# EAGLE design Logging_board (EAGLE 8.4.1)
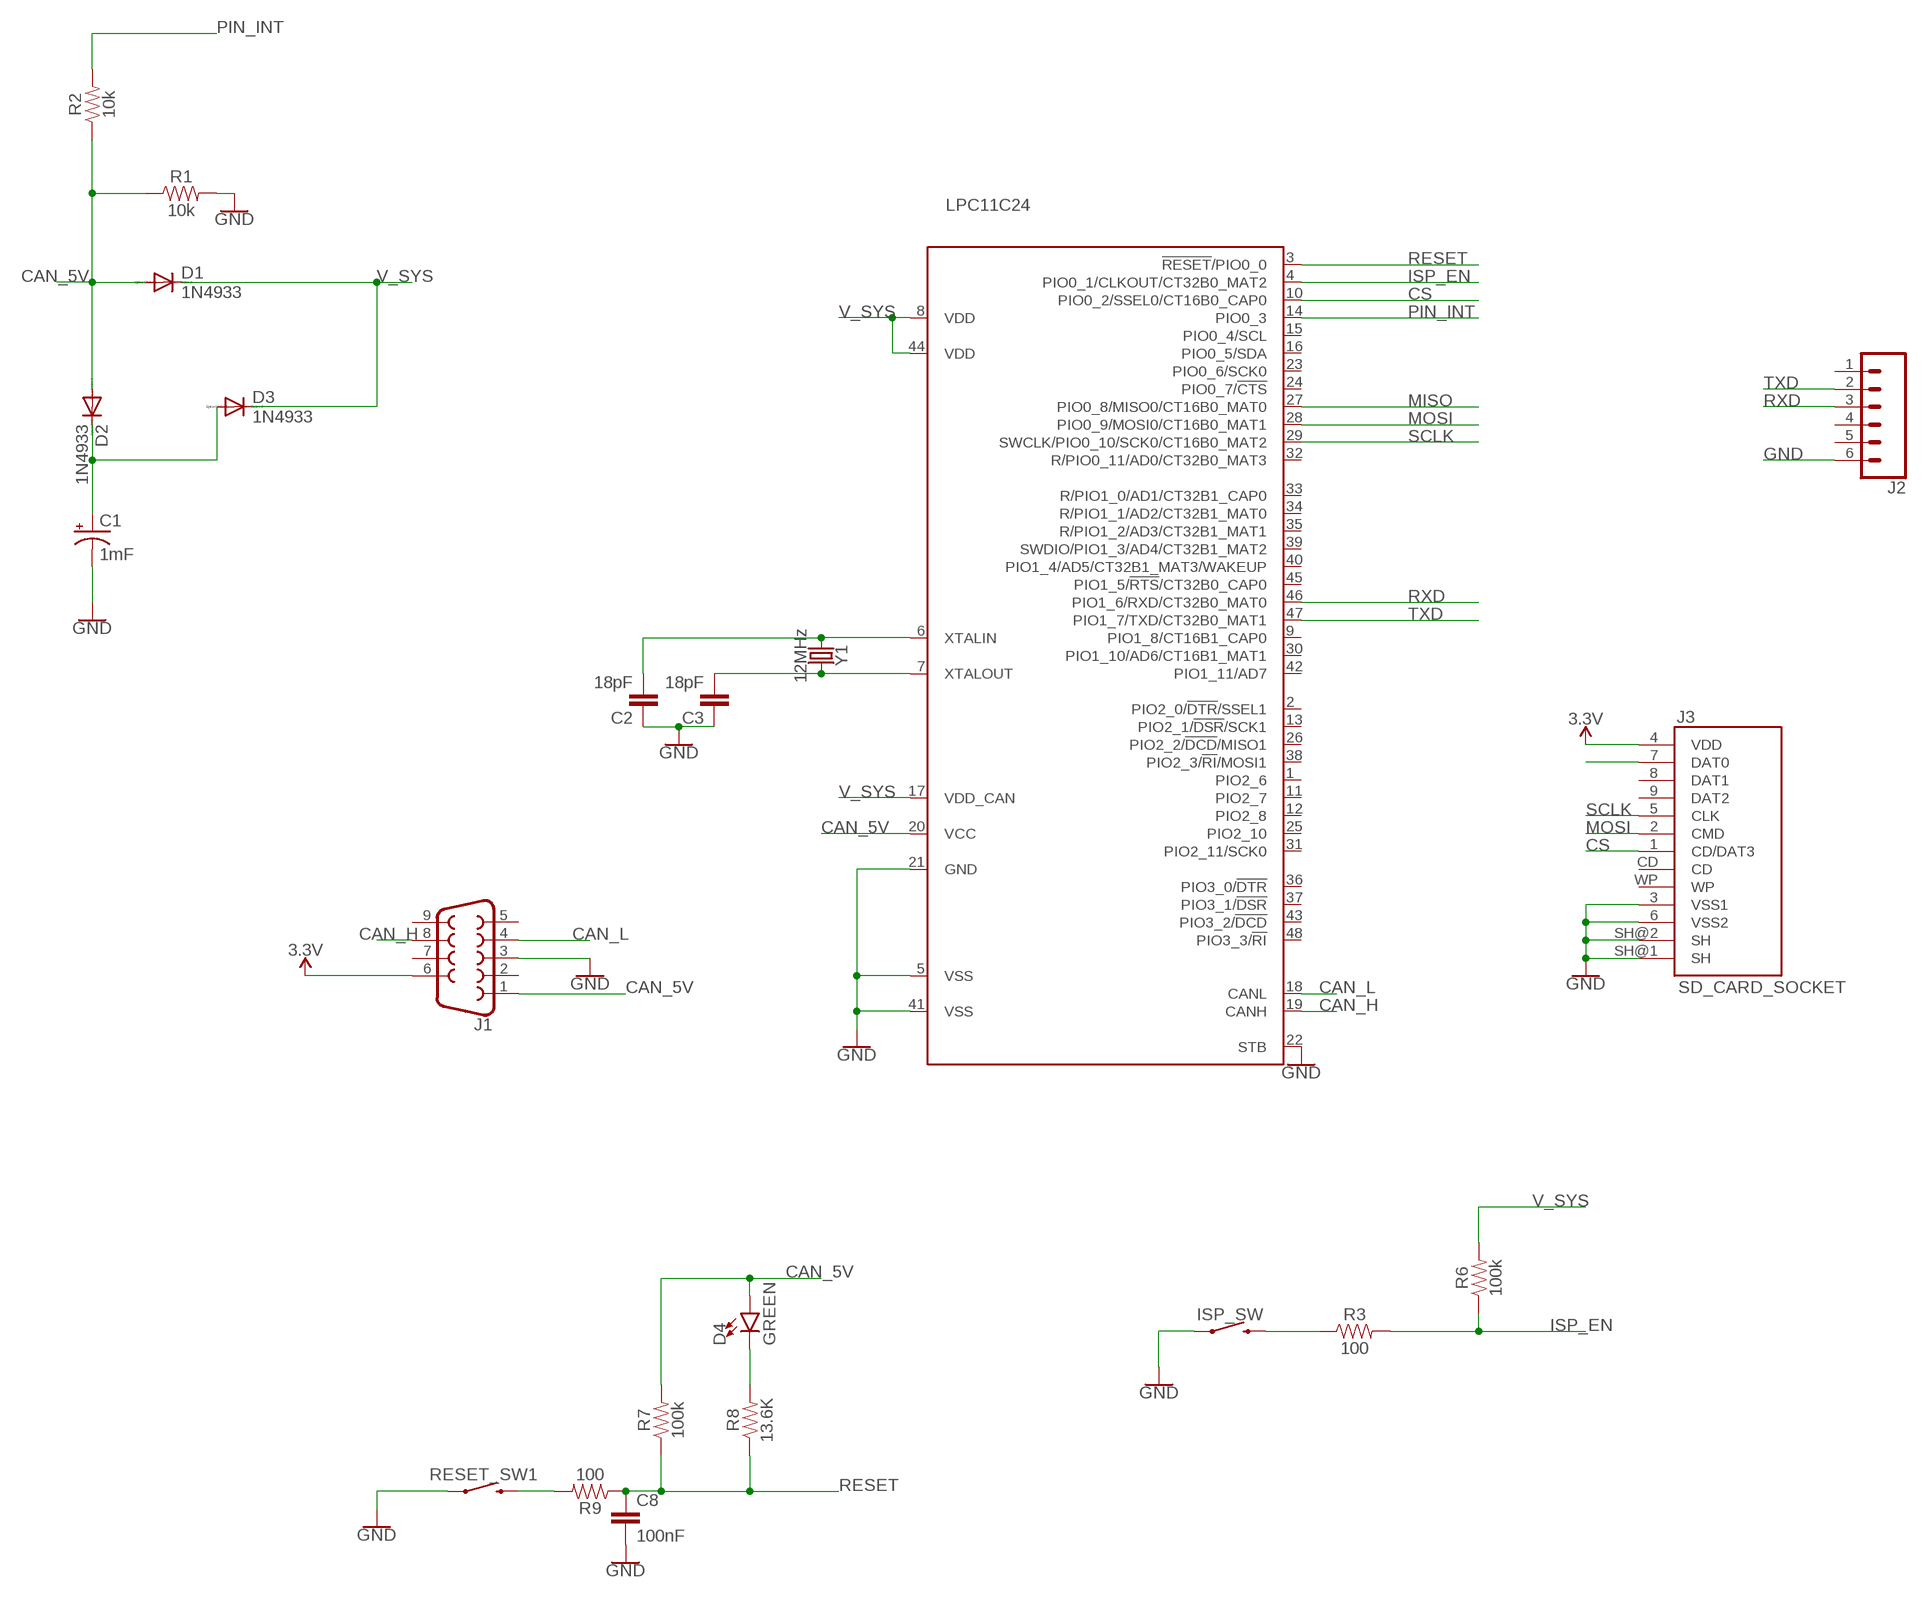
[diagram p0: schematic, sheet 1]

## Parts
C1  1mF  1000UF-RADIAL-5MM-25V-20%  [CPOL-RADIAL-5MM-10MM]
C2  18pF  22PF-PTH-2.54MM-200V-5%  [CAP-PTH-2.54]
C3  18pF  22PF-PTH-2.54MM-200V-5%  [CAP-PTH-2.54]
C8  100nF  22PF-PTH-2.54MM-200V-5%  [CAP-PTH-2.54]
D1  1N4933  [DO41-10]
D2  1N4933  [DO41-10]
D3  1N4933  [DO41-10]
D4  GREEN  LED-GREEN1206  [LED-1206]
ISP_SW  MOMENTARY-SWITCH-SPST-PTH-6.0MM  [TACTILE_SWITCH_PTH_6.0MM]
J1  DB9FEMALE  [DB9]
J2  CONN_06SILK_FEMALE_PTH  [1X06]
J3  SD_CARD_SOCKET  [SD]
LPC11C24  LPC11C22/24-LQFP48  [LQFP48]
R1  10k  10KOHM-HORIZ-1/4W-1%  [AXIAL-0.3]
R2  10k  10KOHM-HORIZ-1/4W-1%  [AXIAL-0.3]
R3  100  100OHM-HORIZ-1/4W-1%  [AXIAL-0.3]
R6  100k  100KOHM-HORIZ-1/4W-1%  [AXIAL-0.3]
R7  100k  100KOHM-HORIZ-1/4W-1%  [AXIAL-0.3]
R8  13.6K  100KOHM-HORIZ-1/4W-1%  [AXIAL-0.3]
R9  100  100KOHM-HORIZ-1/4W-1%  [AXIAL-0.3]
RESET_SW1  MOMENTARY-SWITCH-SPST-PTH-6.0MM  [TACTILE_SWITCH_PTH_6.0MM]
Y1  12MHz  CRYSTAL-16MHZPTH-HC49US  [HC49US]

## Nets
3.3V: J1.6 J3.4(VDD)
CAN_5V: D1.A D2.A D4.A J1.1 LPC11C24.20(VCC) R1.P$1 R2.P$1 R7.P$2
CAN_H: J1.8 LPC11C24.19(CANH)
CAN_L: J1.4 LPC11C24.18(CANL)
CS: J3.1(CD/DAT3) LPC11C24.10(PIO0_2/SSEL0/CT16B0_CAP0)
GND: C1.- C2.1 C3.1 C8.2 ISP_SW.1 J1.3 J2.6 J3.3(VSS1) J3.6(VSS2) J3.SH@1(SH) J3.SH@2(SH) LPC11C24.5(VSS) LPC11C24.21(GND) LPC11C24.22(STB) LPC11C24.41(VSS) R1.P$2 RESET_SW1.1
ISP_EN: LPC11C24.4(PIO0_1/CLKOUT/CT32B0_MAT2) R3.P$2 R6.P$1
MISO: LPC11C24.27(PIO0_8/MISO0/CT16B0_MAT0)
MOSI: J3.2(CMD) LPC11C24.28(PIO0_9/MOSI0/CT16B0_MAT1)
N$1: C1.+ D2.C D3.A
N$3: J3.7(DAT0)
N$4: ISP_SW.3 R3.P$1
N$5: D4.C R8.P$2
N$6: R9.P$2 RESET_SW1.3
PIN_INT: LPC11C24.14(PIO0_3) R2.P$2
RESET: C8.1 LPC11C24.3(!RESET!/PIO0_0) R7.P$1 R8.P$1 R9.P$1
RXD: J2.3 LPC11C24.46(PIO1_6/RXD/CT32B0_MAT0)
SCLK: J3.5(CLK) LPC11C24.29(SWCLK/PIO0_10/SCK0/CT16B0_MAT2)
TXD: J2.2 LPC11C24.47(PIO1_7/TXD/CT32B0_MAT1)
V_SYS: D1.C D3.C LPC11C24.8(VDD) LPC11C24.17(VDD_CAN) LPC11C24.44(VDD) R6.P$2
XTALIN: C2.2 LPC11C24.6(XTALIN) Y1.1
XTALOUT: C3.2 LPC11C24.7(XTALOUT) Y1.2
Unconnected: J1.2 J1.5 J1.7 J1.9 J2.1 J2.4 J2.5 J3.8(DAT1) J3.9(DAT2) J3.CD J3.WP LPC11C24.1(PIO2_6) LPC11C24.2(PIO2_0/!DTR!/SSEL1) LPC11C24.9(PIO1_8/CT16B1_CAP0) LPC11C24.11(PIO2_7) LPC11C24.12(PIO2_8) LPC11C24.13(PIO2_1/!DSR!/SCK1) LPC11C24.15(PIO0_4/SCL) LPC11C24.16(PIO0_5/SDA) LPC11C24.23(PIO0_6/SCK0) LPC11C24.24(PIO0_7/!CTS!) LPC11C24.25(PIO2_10) LPC11C24.26(PIO2_2/!DCD!/MISO1) LPC11C24.30(PIO1_10/AD6/CT16B1_MAT1) LPC11C24.31(PIO2_11/SCK0) LPC11C24.32(R/PIO0_11/AD0/CT32B0_MAT3) LPC11C24.33(R/PIO1_0/AD1/CT32B1_CAP0) LPC11C24.34(R/PIO1_1/AD2/CT32B1_MAT0) LPC11C24.35(R/PIO1_2/AD3/CT32B1_MAT1) LPC11C24.36(PIO3_0/!DTR!) LPC11C24.37(PIO3_1/!DSR!) LPC11C24.38(PIO2_3/!RI!/MOSI1) LPC11C24.39(SWDIO/PIO1_3/AD4/CT32B1_MAT2) LPC11C24.40(PIO1_4/AD5/CT32B1_MAT3/WAKEUP) LPC11C24.42(PIO1_11/AD7) LPC11C24.43(PIO3_2/!DCD!) LPC11C24.45(PIO1_5/!RTS!/CT32B0_CAP0) LPC11C24.48(PIO3_3/!RI!)

## Library data of the parts
C1 = SparkFun-Capacitors:1000UF: 1,000µF/1mF ceramic capacitors A capacitor is a passive two-terminal electrical component used to store electrical energy temporarily in an electric field. CAP-08070; PROD_ID: CAP-09538
C2 C3 C8 = SparkFun-Capacitors:22PF: 22pF ceramic capacitors A capacitor is a passive two-terminal electrical component used to store electrical energy temporarily in an electric field.; PROD_ID: CAP-09128; VALUE: 22pF
D1-D3 = diode:1N4933: DIODE fast recovery rectifier, 1A
D4 = SparkFun-LED:LED-GREEN: Green SMD LED Used in manufacturing of various products at SparkFun Packages: 0603 - SMD 0603 package [Product Link] <http://www.futureelectronics.com/en/technologies/semiconductors/optoelectronics/leds/Pages/9894312-LTST-C190GKT.aspx?CrossPart=HSMG-C190&IM=0> LilyPad 1206 - SMD1206 LilyPad package [Product Link] <http://www.futureelectronics.com/en/Technologies/Product.aspx?ProductID=IN150NGHARVATEKCORPORATION2049943&IM=0> 1206 - SMD1206 package [Product Link] <http://www.futureelectronics.com/en/technologies/semiconductors/optoelectronics/leds/Pages/8315665-LTST-C150KGKT.aspx?IM=0> 1206 Bottom Mount -SMD 1206 Bottom Mount [Product Link] <http://www.digikey.com/product-detail/en/lite-on-inc/LTST-C230KGKT/160-1456-1-ND/386854> SparkFun Products: Pro Mini 328 -5V <https://www.sparkfun.com/products/821> RedBoard <https://www.sparkfun.com/products/12757> MP3 Trigger <https://www.sparkfun.com/products/13720> Makey Makey <https://www.sparkfun.com/products/11076>; PROD_ID: DIO-00862
ISP_SW RESET_SW1 = SparkFun-Switches:MOMENTARY-SWITCH-SPST: Momentary Switch (Pushbutton) - SPST Normally-open (NO) SPST momentary switches (buttons, pushbuttons). Variants PTH-12MM - 12mm square, through-hole Momentary Pushbutton Switch - 12mm Square <https://www.sparkfun.com/products/9190> (COM-09190) PTH-6.0MM, PTH-6.0MM-KIT - 6.0mm square, through-hole Mini Pushbutton Switch <https://www.sparkfun.com/products/97> (COM-00097) KIT package intended for soldering kit's - only one side of pads' copper is exposed. PTH-RIGHT-ANGLE-KIT - Right-angle, through-hole Right Angle Tactile Button <https://www.sparkfun.com/products/10791> - Used on SparkFun BigTime Watch Kit <https://www.sparkfun.com/products/11734> SMD-12MM - 12mm square, surface-mount Tactile Button - SMD (12mm) <https://www.sparkfun.com/products/12993> (COM-12993) Used on SparkFun PicoBoard <https://www.sparkfun.com/products/11888> SMD-4.5MM - 4.5mm Square Trackball Switch Used on SparkFun Blackberry Trackballer Breakout <https://www.sparkfun.com/products/13169> SMD-4.6MMX2.8MM - 4.60mm x 2.80mm, surface mount Used on SparkFun SAMD21 Mini Breakout <https://www.sparkfun.com/products/13664> SMD-5.2MM, SMD-5.2-REDUNDANT - 5.2mm square, surface-mount Mini Pushbutton Switch - SMD <https://www.sparkfun.com/products/8720> (COM-08720) Used on Arduino Pro Mini <https://www.sparkfun.com/products/11114> REDUNDANT package connects both switch circuits together SMD-6.0X3.5MM - 6.0 x 3.5mm, surface mount Momentary Reset Switch SMD <https://www.sparkfun.com/products/8229> (COM-08229) SMD-6.2MM-TALL - 6.2mm square, surface mount Tactile Button - SMD (6mm) <https://www.sparkfun.com/products/12992> Used on SparkFun Digital Sandbox <https://www.sparkfun.com/products/12651> SMD-RIGHT-ANGLE - Right-angle, surface mount Used on SparkFun Block for Intel® Edison - Arduino <https://www.sparkfun.com/products/13036>; PROD_ID: SWCH-08441; SF_SKU: COM-00097
J1 = SparkFun-Connectors:DB9: DB9 Connector Standard DB9 (D-Sub 9) serial connector. Can be used for CAN bus as well as RS485 and RS232. Footprint production proven. Here is the female version connector we sell at SparkFun: 9 Pin Female Serial Connector - PCB Mount <https://www.sparkfun.com/products/429> (PRT-00429) This connector has been used on the following SparkFun products: SparkFun RS232 Shifter - SMD <https://www.sparkfun.com/products/449> (PRT-00449) SparkFun RS232 Shifter SMD (No DB9) <https://www.sparkfun.com/products/8780> (PRT-08780); PROD_ID: CONN-08194
J2 = SparkFun-Connectors:CONN_06: Multi connection point. Often used as Generic Header-pin footprint for 0.1 inch spaced/style header connections On any of the 0.1 inch spaced packages, you can populate with these: Break Away Headers - Straight <https://www.sparkfun.com/products/116> (PRT-00116) Break Away Male Headers - Right Angle <https://www.sparkfun.com/products/553> (PRT-00553) Female Headers <https://www.sparkfun.com/products/115> (PRT-00115) Break Away Headers - Machine Pin <https://www.sparkfun.com/products/117> (PRT-00117) Break Away Female Headers - Swiss Machine Pin <https://www.sparkfun.com/products/743> (PRT-00743) Arduino Stackable Header - 6 Pin <https://www.sparkfun.com/products/9280> (PRT-09280) For SCREWTERMINALS and SPRING TERMINALS visit here: Screw Terimnals on SparkFun.com <https://www.sparkfun.com/search/results?term=Screw+Terminals> (5mm/3.5mm/2.54mm spacing) This device is also useful as a general connection point to wire up your design to another part of your project. Our various solder wires solder well into these plated through hole pads. Hook-Up Wire - Assortment (Stranded, 22 AWG) <https://www.sparkfun.com/products/11375> (PRT-11375) Hook-Up Wire - Assortment (Solid Core, 22 AWG) <https://www.sparkfun.com/products/11367> (PRT-11367) View the entire wire category on our website here <https://www.sparkfun.com/categories/141>; PROD_ID: CONN-08437
J3 = SparkFun-Connectors:SD_CARD_SOCKET: SD Memory Card Connector (standard "large" size) Push-push normal type, CD enable, WP enable. Here is the connector we sell at SparkFun: SD/MMC Socket <https://www.sparkfun.com/products/12769> (PRT-12769) Datasheet <https://cdn.sparkfun.com/datasheets/Prototyping/19608.pdf> It is used on these SparkFun products: SparkFun SD/MMC Card Breakout <https://www.sparkfun.com/products/12941> (BOB-12941) SD Sniffer <https://www.sparkfun.com/products/11468> (TOL-11468); PROD_ID: CONN-11976; SF_ID: PRT-12769
LPC11C24 = lpc1100v1.1:LPC11C22/24-LQFP48: NXP Semiconductors LPC11Cxx microcontrollers <http://ics.nxp.com/products/lpc1000/lpc11xx/lpc11cxx/> ARM 32-bit Cortex-M0 Microcontroller with MPU CPU clock up to 50MHz 32KByte on-chip Flash ROM with In-System Programming (ISP) and In-Application Programming (IAP) via On-Chip Bootloader 8KByte SRAM Nested Vectored Interrupt Controller 2 SPI controllers CAN controller On-chip, high-speed CAN transciever UART with full Modem Interface and RS485 Support Fast Mode I2C-Bus 4 Timers with 4 capture channels and 12 output channels Watchdog (WDT) Sytem tick timer 10-bit ADC with 8 channels Power Management Unit (PMU) Brownout detection 12MHz internal RC oscillator Serial Wire Debug/Trace port
R1 R2 = SparkFun-Resistors:10KOHM: 10kΩ resistor A resistor is a passive two-terminal electrical component that implements electrical resistance as a circuit element. Resistors act to reduce current flow, and, at the same time, act to lower voltage levels within circuits. - Wikipedia; PROD_ID: RES-12183
R3 = SparkFun-Resistors:100OHM: 100Ω resistor A resistor is a passive two-terminal electrical component that implements electrical resistance as a circuit element. Resistors act to reduce current flow, and, at the same time, act to lower voltage levels within circuits. - Wikipedia; PROD_ID: RES-12181
R6 R7 = SparkFun-Resistors:100KOHM: 100kΩ resistor A resistor is a passive two-terminal electrical component that implements electrical resistance as a circuit element. Resistors act to reduce current flow, and, at the same time, act to lower voltage levels within circuits. - Wikipedia; PROD_ID: RES-12184
R8 R9 = SparkFun-Resistors:100KOHM: 100kΩ resistor A resistor is a passive two-terminal electrical component that implements electrical resistance as a circuit element. Resistors act to reduce current flow, and, at the same time, act to lower voltage levels within circuits. - Wikipedia; PROD_ID: RES-12184; VALUE: 100k
Y1 = SparkFun-Clocks:CRYSTAL-16MHZ: 16MHz Crystal Digikey Example <http://www.digikey.com/product-search/en?keywords=535-9122-1-ND> Frequency: 16MHz Frequency Stability: ±50ppm Frequency Tolerance: ±20ppm Load Capacitance: 18pF SparkFun Products: Pro Micro -5V/16MHz <https://www.sparkfun.com/products/12640> SparkFun Serial Enabled LCD Kit <https://www.sparkfun.com/products/10097>; PROD_ID: XTAL-08181; SF_ID: COM-00536; VALUE: 16MHz

## Board
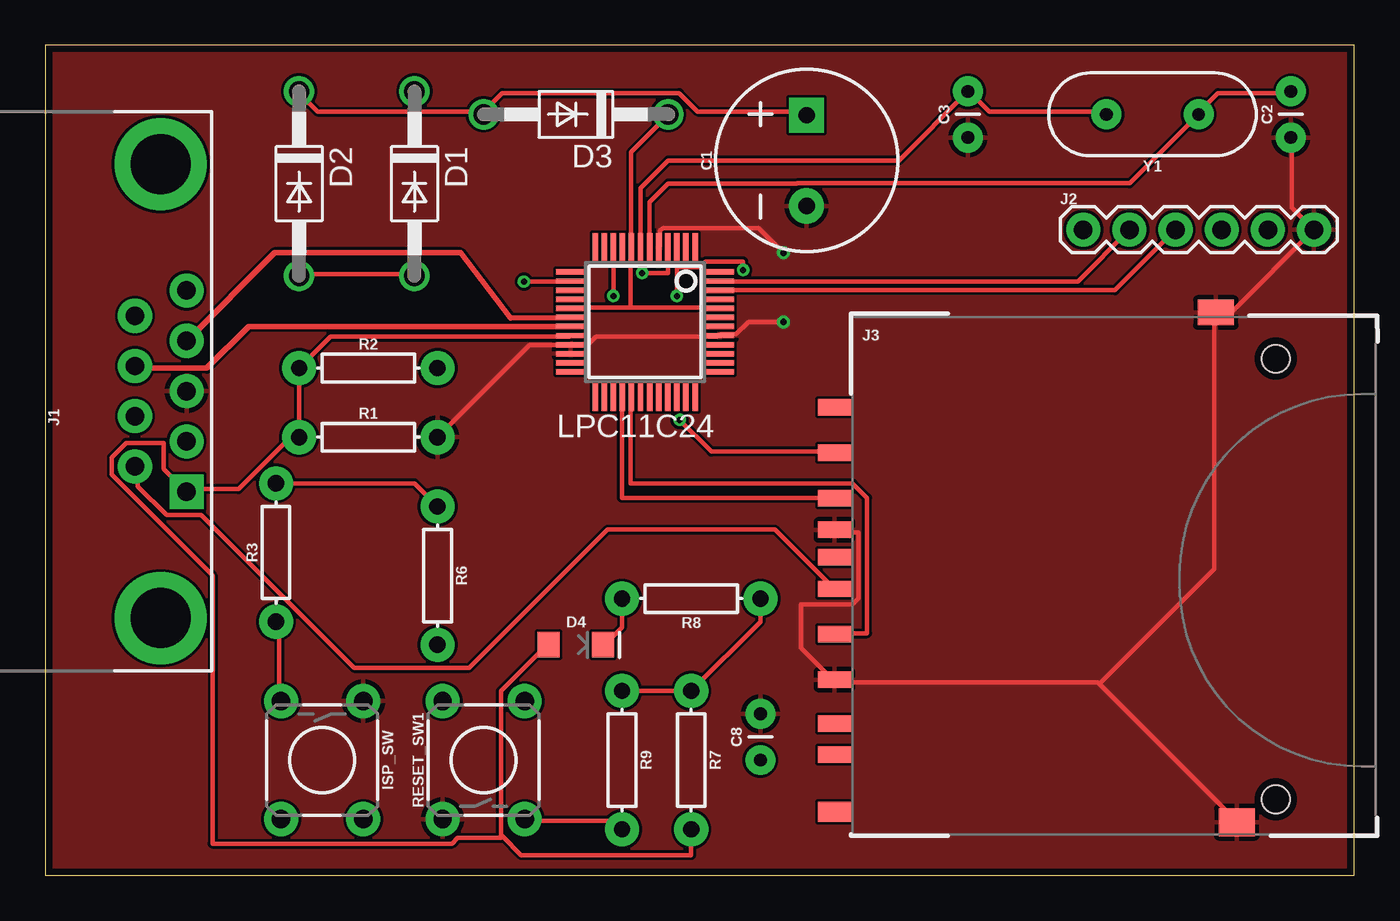
[diagram p1: board, top side]
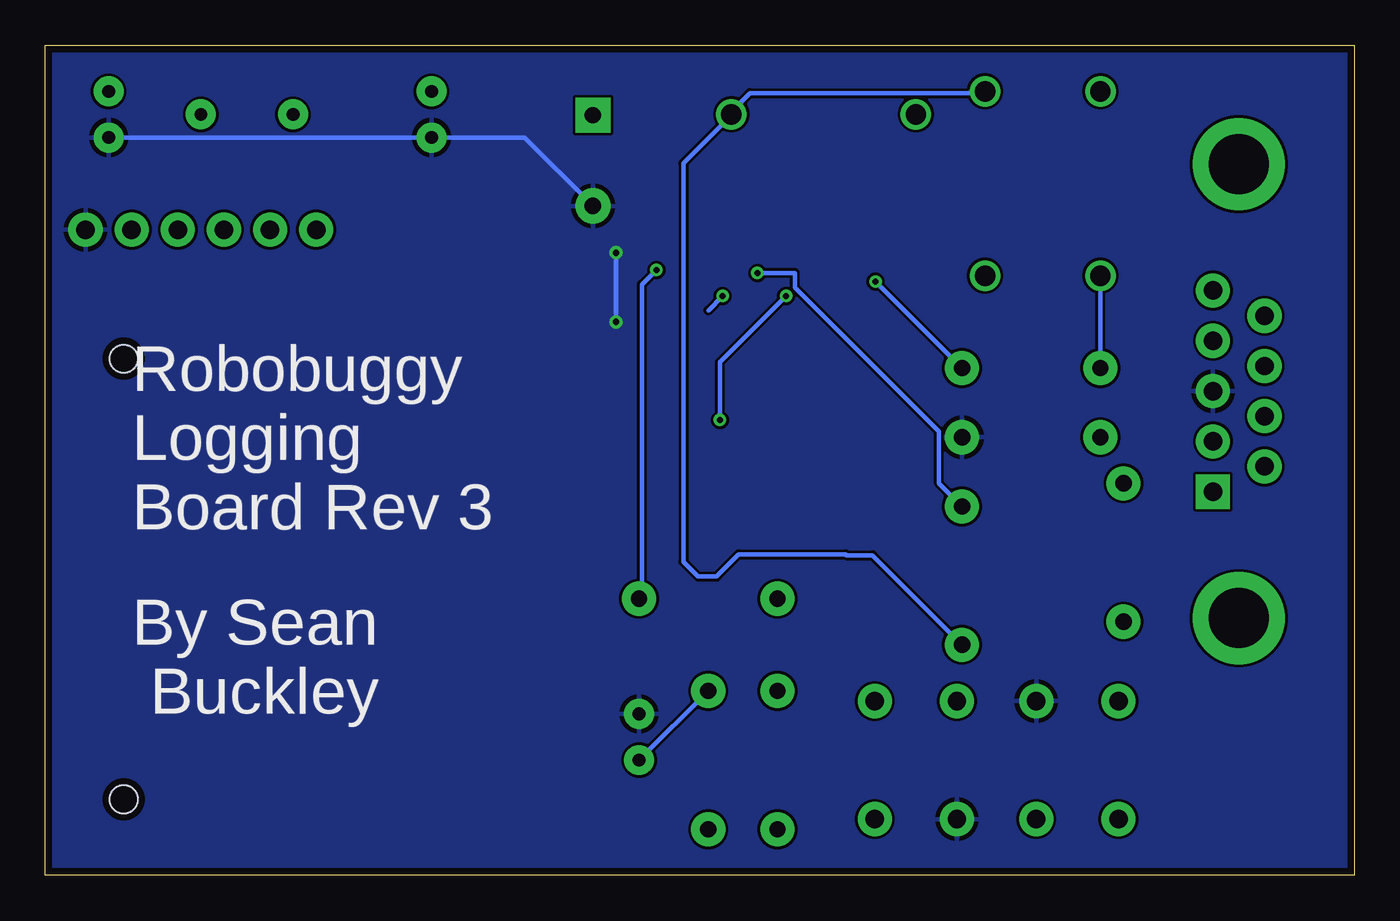
[diagram p2: board, bottom side, seen from below]

Size 72.06 x 45.71 mm. Coordinates in mm from the lower left corner, seen from the top.
Outline: 0,0 72.06,0 72.06,45.71 0,45.71 0,0
Copper layers (1*16): Top 0.0356mm / dielectric 1.5011mm / Bottom 0.0356mm
Design rules "oshpark-2layer *": minimum track width 10mil, minimum drill 13mil, track to track 6mil, track to pad 6mil, pad to pad 6mil, via to via 6mil, smd to smd 6mil, copper to edge 15mil, drill to drill 6mil, minimum pad ring 7mil, minimum via ring 7mil, stop-mask expansion 2.5mil, vias tented up to drill 0mil, thermal gap 10mil

### Footprints (pad centres in the part's own frame; a part is rotated, then mirrored left to right if it is on the bottom)
CPOL-RADIAL-5MM-10MM = drill 0.9 pad 1.93 square: + 2.5,0 | drill 0.9 pad 1.93: - -2.5,0
CAP-PTH-2.54 = drill 0.7 pad 1.651: 1 -1.27,0; 2 1.27,0
DO41-10 = drill 1.118: A 5.08,0; C -5.08,0
LED-1206 = smd 1.2 x 1.4: A -1.5,0; C 1.5,0
TACTILE_SWITCH_PTH_6.0MM = drill 1.016 pad 1.88: 1 -3.251,2.261; 2 3.251,2.261; 3 -3.251,-2.261; 4 3.251,-2.261
DB9 = drill 1.016 pad 1.88 square: 1 -5.54,-1.42 | drill 1.016 pad 1.88: 2 -2.77,-1.42; 3 0,-1.42; 4 2.77,-1.42; 5 5.54,-1.42; 6 -4.15,1.42; 7 -1.38,1.42; 8 1.38,1.42; 9 4.15,1.42 | drill 3.302 pad 5.08: G1 -12.5,0; G2 12.5,0
1X06 = drill 1.016 pad 1.88: 1 0,0; 2 2.54,0; 3 5.08,0; 4 7.62,0; 5 10.16,0; 6 12.7,0
SD = smd 1.8 x 0.9: 1 -1,6.77; 2 -1,4.27; 3 -1,2.52; 4 -1,-0.73; 5 -1,-3.23; 6 -1,-5.73; 7 -1,-8.15; 8 -1,-9.85; 9 -1,9.27; CD -1,1.02 | smd 2 x 1.4: SH@1 20,14.496 | smd 2 x 1.527: SH@2 21.15,-13.589 | smd 1.8 x 1.1: WP -1,-13 | hole 1.55: 23.3,11.94; 23.3,-12.32
LQFP48 = smd 0.3 x 1.6: 1 -2.75,-4.1; 2 -2.25,-4.1; 3 -1.75,-4.1; 4 -1.25,-4.1; 5 -0.75,-4.1; 6 -0.25,-4.1; 7 0.25,-4.1; 8 0.75,-4.1; 9 1.25,-4.1; 10 1.75,-4.1; 11 2.25,-4.1; 12 2.75,-4.1; 25 2.75,4.1; 26 2.25,4.1; 27 1.75,4.1; 28 1.25,4.1; 29 0.75,4.1; 30 0.25,4.1; 31 -0.25,4.1; 32 -0.75,4.1; 33 -1.25,4.1; 34 -1.75,4.1; 35 -2.25,4.1; 36 -2.75,4.1 | smd 1.6 x 0.3: 13 4.1,-2.75; 14 4.1,-2.25; 15 4.1,-1.75; 16 4.1,-1.25; 17 4.1,-0.75; 18 4.1,-0.25; 19 4.1,0.25; 20 4.1,0.75; 21 4.1,1.25; 22 4.1,1.75; 23 4.1,2.25; 24 4.1,2.75; 37 -4.1,2.75; 38 -4.1,2.25; 39 -4.1,1.75; 40 -4.1,1.25; 41 -4.1,0.75; 42 -4.1,0.25; 43 -4.1,-0.25; 44 -4.1,-0.75; 45 -4.1,-1.25; 46 -4.1,-1.75; 47 -4.1,-2.25; 48 -4.1,-2.75
AXIAL-0.3 = drill 0.9 pad 1.88: P$1 -3.81,0; P$2 3.81,0
HC49US = drill 0.7 pad 1.651: 1 -2.54,0; 2 2.54,0

### Placement (x,y rotation side)
C1  41.91,39.37 90 top
C2  68.58,41.91 90 top
C3  50.8,41.91 90 top
C8  39.37,7.62 90 top
D1  20.32,38.1 270 top
D2  13.97,38.1 270 top
D3  29.21,41.91 180 top
D4  29.21,12.7 0 top
ISP_SW  15.24,6.35 270 top
J1  6.35,26.67 90 top
J2  57.15,35.56 0 top
J3  44.45,16.51 0 top
LPC11C24  33.02,30.48 180 top
R1  17.78,24.13 0 top
R2  17.78,27.94 0 top
R3  12.7,17.78 90 top
R6  21.59,16.51 270 top
R7  35.56,6.35 270 top
R8  35.56,15.24 180 top
R9  31.75,6.35 270 top
RESET_SW1  24.13,6.35 90 top
Y1  60.96,41.91 180 top

### Tracks (layer width: path | path; a pad name or v marks a point on that pad's centre or on a via)
3.3V
  Top 0.254: J3.4 43.34,15.88 40.16,19.05 30.96,19.05 23.34,11.43 16.99,11.43 8.57,19.84 6.67,19.84 5.08,21.43 5.08,22.38 J1.6
CAN_5V
  Top 0.254: D1.A 20.27,33.12 13.97,33.12 D2.A | LPC11C24.20 28.89,29.69 15.72,29.69 R2.P$1 R1.P$1 13.49,24.13 10.64,21.27 7.78,21.27 J1.1 7.62,21.27 6.51,22.38 6.51,23.81 4.45,23.81 3.65,23.02 3.65,22.07 9.21,16.51 9.21,1.75 22.38,1.75 22.7,2.06 25.08,2.06 25.16,2.14 | 25.16,2.14 26.19,1.11 35.56,1.11 R7.P$2 | 25.16,2.14 25.08,2.22 25.08,10.16 27.62,12.7 D4.A
  Bottom 0.254: R2.P$1 D2.A
CAN_H
  Top 0.305: LPC11C24.19 11.18,30.23 8.89,27.94 5.04,27.94 J1.8
CAN_L
  Top 0.305: J1.4 12.62,34.29 22.86,34.29 25.61,30.69 LPC11C24.18
CS  (via drill 0.33)
  Top 0.254: v31.27,31.91 31.27,34.45 LPC11C24.10 | v34.92,25.08 36.67,23.34 43.34,23.34 J3.1
  Bottom 0.254: v31.27,31.91 34.92,28.26 v34.92,25.08
GND  (via drill 0.35)
  Top 0.254: R1.P$2 26.67,29.21 28.89,29.21 LPC11C24.21 29.05,29.21 29.84,29.21 30.32,29.69 36.99,29.69 LPC11C24.41 37.19,29.8 38.04,29.8 38.71,30.48 v40.64,30.48 | J3.3 43.5,18.89 44.77,18.89 44.77,15.24 44.45,14.92 41.59,14.92 41.59,12.54 43.34,10.79 J3.6 43.5,10.64 57.94,10.64 58.04,10.54 | 58.04,10.54 65.56,3.02 J3.SH@2 | C2.1 68.63,40.64 68.63,36.78 J2.6 65.38,31.09 64.57,31.09 J3.SH@1 64.36,30.89 64.36,16.87 58.04,10.54 | LPC11C24.5 33.84,34.65 33.84,35.5 34,35.66 39.27,35.66 v40.64,34.29
  Bottom 0.254: C1.- 42.01,36.98 45.67,40.64 C3.1 C2.1 | v40.64,30.48 v40.64,34.29
  pour Bottom: 0,45.72 72.39,45.72 72.39,0 0,0
  pour Top: 0,45.72 72.39,45.72 72.39,0 0,0
ISP_EN  (via drill 0.33)
  Top 0.254: R3.P$2 20.32,21.59 R6.P$1 | v32.86,33.18 34.29,33.18 34.29,34.45 LPC11C24.4
  Bottom 0.254: v32.86,33.18 30.8,33.18 30.8,32.38 22.86,24.45 22.86,21.59 R6.P$1
MOSI
  Top 0.254: LPC11C24.28 31.75,26.35 31.75,20.8 43.34,20.8 J3.2
N$1
  Top 0.254: 24.13,42.06 14.99,42.06 13.97,43.08 D2.C | 24.13,42.06 25.15,43.08 34.9,43.08 35.92,42.06 41.81,42.06 C1.+ | 24.13,42.06 D3.A
N$4
  Top 0.254: R3.P$1 12.86,13.81 12.86,9.68 ISP_SW.3
N$5
  Top 0.254: R8.P$2 31.75,13.65 30.8,12.7 D4.C
N$6
  Top 0.254: R9.P$2 31.75,3.02 26.51,3.02 RESET_SW1.3
PIN_INT  (via drill 0.33)
  Top 0.254: v26.35,32.7 28.89,32.7 LPC11C24.14
  Bottom 0.254: R2.P$2 v26.35,32.7
RESET  (via drill 0.33)
  Top 0.254: v34.77,31.91 34.77,33.5 | 34.77,33.5 34.77,34.45 LPC11C24.3 | R9.P$1 R7.P$1 39.37,13.97 R8.P$1 | 34.77,33.5 36.04,33.5 36.35,33.81 38.42,33.81 v38.42,33.34
  Bottom 0.254: 35.56,31.11 v34.77,31.91 | R7.P$1 C8.1 | v38.42,33.34 39.21,32.54 39.21,15.24 R8.P$1
RXD
  Top 0.254: J2.3 58.9,32.23 LPC11C24.46
SCLK
  Top 0.254: LPC11C24.29 32.23,26.35 32.23,21.59 44.45,21.59 45.24,20.8 45.24,13.34 43.5,13.34 J3.5
TXD
  Top 0.254: J2.2 56.84,32.72 37.13,32.72 LPC11C24.47
V_SYS
  Top 0.254: 32.23,31.27 36.99,31.27 LPC11C24.44 | 32.23,31.27 29.05,31.27 LPC11C24.17 | 32.23,31.27 32.23,34.45 LPC11C24.8 32.26,34.75 32.26,39.83 34.29,41.86 D3.C
  Bottom 0.254: D1.C 20.47,43.08 33.27,43.08 34.29,42.06 D3.C 34.29,41.86 36.93,39.22 36.93,17.27 36.12,16.46 35.1,16.46 33.88,17.68 27.99,17.68 27.94,17.62 26.51,17.62 R6.P$2
XTALIN
  Top 0.254: C2.2 68.43,43.08 64.57,43.08 63.55,42.06 Y1.1 59.7,38.12 41.39,38.12 41.38,38.1 34.29,38.1 33.27,37.08 LPC11C24.6
XTALOUT
  Top 0.254: Y1.2 58.27,42.06 51.97,42.06 50.95,43.08 C3.2 46.99,39.37 34.29,39.37 32.77,37.85 LPC11C24.7

### Text on the board
bPlace: Robobuggy / Logging / Board Rev 3 | By Sean / Buckley